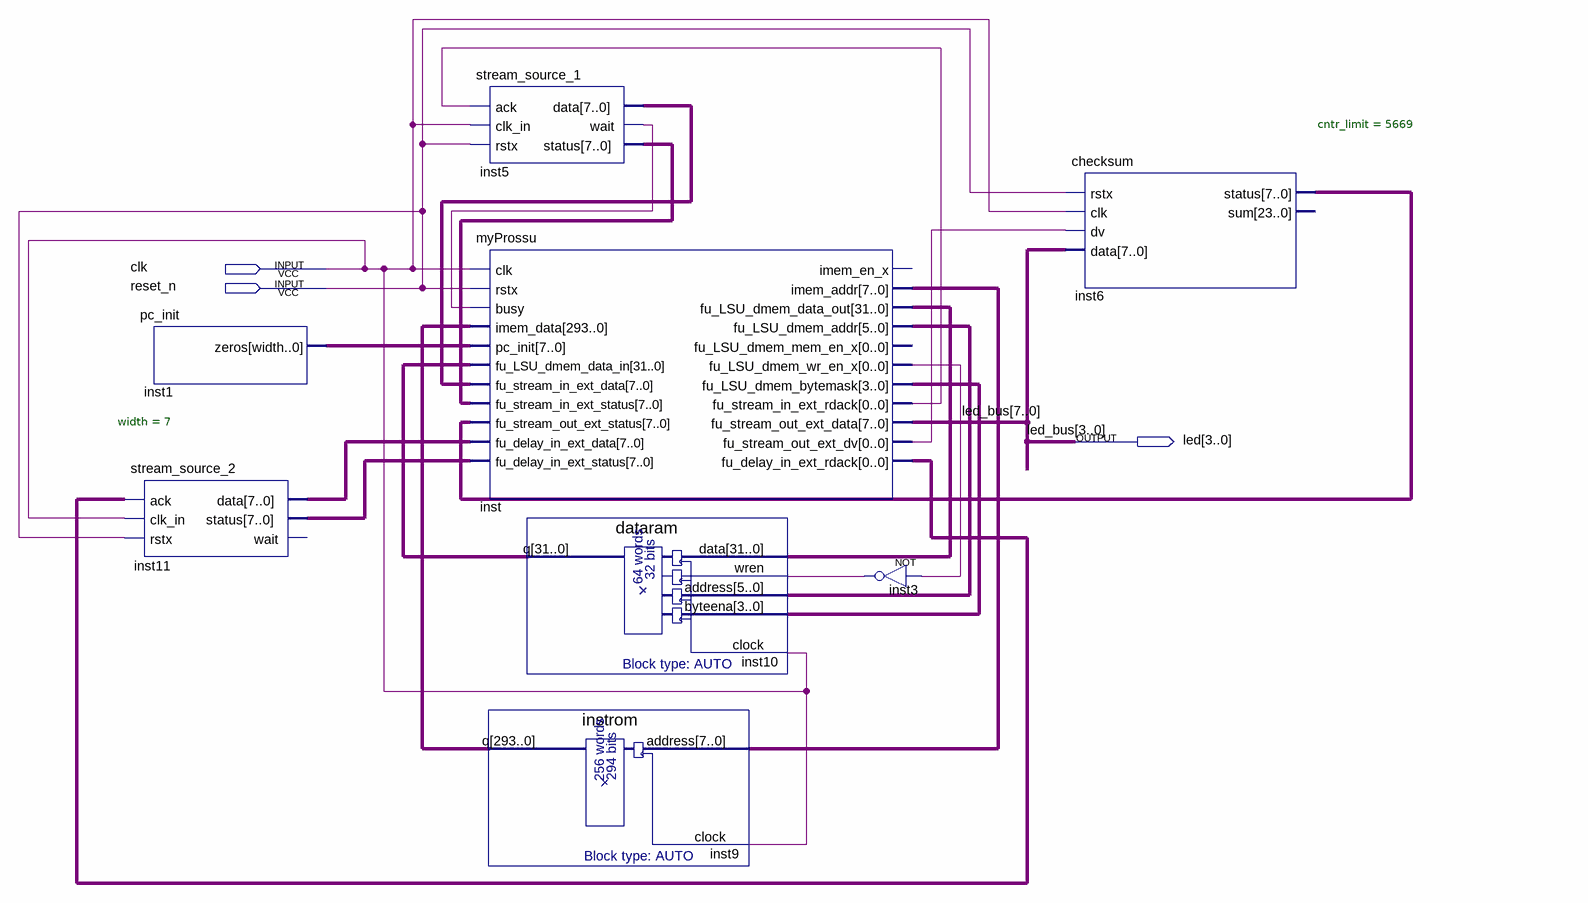
[diagram p0: schematic sheet]
// Quartus schematic tta_farrow.bdf as structural Verilog: 8 symbols, 3 pins
module tta_farrow (
  input  clk,
  input  reset_n,
  output [3:0] led
);

  wire inst3_out, inst5_wait, inst_fu_delay_in_ext_rdack, inst_fu_lsu_dmem_wr_en_x,
       inst_fu_stream_in_ext_rdack, inst_fu_stream_out_ext_dv;
  wire [3:0] inst_fu_lsu_dmem_bytemask;
  wire [5:0] inst_fu_lsu_dmem_addr;
  wire [7:0] inst1_zeros, inst5_data, inst5_status, inst6_status, inst11_data, inst11_status, inst_imem_addr;
  wire [7:4] led_bus;
  wire [31:0] inst10_q, inst_fu_lsu_dmem_data_out;
  wire [293:0] inst9_q;

  pc_init #(.width(7)) inst1 (.zeros(inst1_zeros));
  stream_source_2 inst11 (
    .ack(inst_fu_delay_in_ext_rdack), .clk_in(clk), .rstx(reset_n), .data(inst11_data), .status(inst11_status));  // open: wait
  stream_source_1 inst5 (
    .ack(inst_fu_stream_in_ext_rdack), .clk_in(clk), .rstx(reset_n), .data(inst5_data), .\wait (inst5_wait),
    .status(inst5_status));
  myProssu inst (
    .clk(clk), .rstx(reset_n), .busy(inst5_wait), .imem_data(inst9_q), .pc_init(inst1_zeros),
    .fu_LSU_dmem_data_in(inst10_q), .fu_stream_out_ext_status(inst6_status),
    .fu_stream_in_ext_data(inst5_data), .fu_stream_in_ext_status(inst5_status),
    .fu_delay_in_ext_data(inst11_data), .fu_delay_in_ext_status(inst11_status), .imem_addr(inst_imem_addr),
    .fu_LSU_dmem_data_out(inst_fu_lsu_dmem_data_out), .fu_LSU_dmem_addr(inst_fu_lsu_dmem_addr),
    .fu_LSU_dmem_wr_en_x(inst_fu_lsu_dmem_wr_en_x), .fu_LSU_dmem_bytemask(inst_fu_lsu_dmem_bytemask),
    .fu_stream_out_ext_data({led_bus, led}), .fu_stream_out_ext_dv(inst_fu_stream_out_ext_dv),
    .fu_stream_in_ext_rdack(inst_fu_stream_in_ext_rdack), .fu_delay_in_ext_rdack(inst_fu_delay_in_ext_rdack));  // open: imem_en_x, fu_LSU_dmem_mem_en_x
  dataram inst10 (
    .data(inst_fu_lsu_dmem_data_out), .wren(inst3_out), .address(inst_fu_lsu_dmem_addr),
    .byteena(inst_fu_lsu_dmem_bytemask), .clock(clk), .q(inst10_q));
  instrom inst9 (.address(inst_imem_addr), .clock(clk), .q(inst9_q));
  not inst3 (inst3_out, inst_fu_lsu_dmem_wr_en_x);
  checksum #(.cntr_limit(5669)) inst6 (
    .rstx(reset_n), .clk(clk), .dv(inst_fu_stream_out_ext_dv), .data({led_bus, led}), .status(inst6_status));  // open: sum

  // Other names for the same wires on the sheet: led_bus[3:0] = led
endmodule
